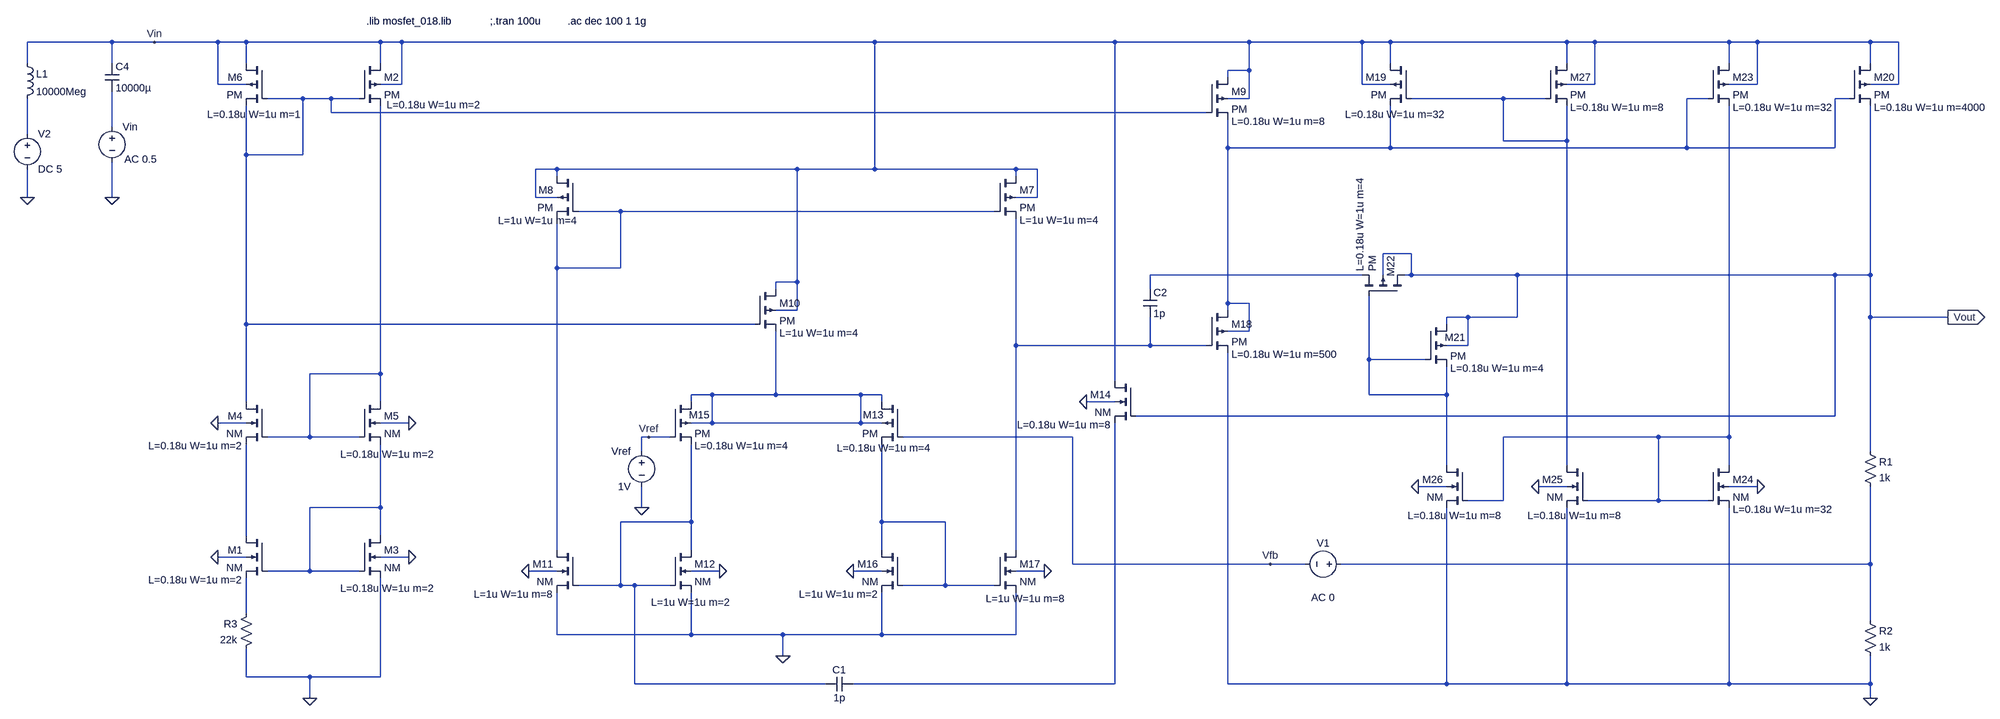
[diagram p0: schematic LDO_PSRR.asc]
LDO_PSRR.asc, the LTspice schematic file:
Version 4
SHEET 1 3764 1792
WIRE -512 80 -704 80
WIRE -416 80 -512 80
WIRE -272 80 -416 80
WIRE -208 80 -272 80
WIRE 96 80 -208 80
WIRE 144 80 96 80
WIRE 1216 80 144 80
WIRE 1760 80 1216 80
WIRE 2064 80 1760 80
WIRE 2320 80 2064 80
WIRE 2384 80 2320 80
WIRE 2784 80 2384 80
WIRE 2848 80 2784 80
WIRE 3152 80 2848 80
WIRE 3216 80 3152 80
WIRE 3472 80 3216 80
WIRE 3536 80 3472 80
WIRE -704 128 -704 80
WIRE -512 128 -512 80
WIRE -208 128 -208 80
WIRE 96 128 96 80
WIRE 2384 128 2384 80
WIRE 2784 128 2784 80
WIRE 3152 128 3152 80
WIRE 3472 128 3472 80
WIRE 2064 144 2064 80
WIRE 2064 144 2016 144
WIRE 2016 160 2016 144
WIRE -272 176 -272 80
WIRE -208 176 -272 176
WIRE 144 176 144 80
WIRE 144 176 96 176
WIRE 2320 176 2320 80
WIRE 2384 176 2320 176
WIRE 2848 176 2848 80
WIRE 2848 176 2784 176
WIRE 3216 176 3216 80
WIRE 3216 176 3152 176
WIRE 3536 176 3536 80
WIRE 3536 176 3472 176
WIRE -80 208 -160 208
WIRE -16 208 -80 208
WIRE 48 208 -16 208
WIRE 2064 208 2064 144
WIRE 2064 208 2016 208
WIRE 2640 208 2432 208
WIRE 2736 208 2640 208
WIRE 3104 208 3056 208
WIRE 3424 208 3392 208
WIRE -16 240 -16 208
WIRE 1968 240 -16 240
WIRE -512 272 -512 192
WIRE -704 288 -704 208
WIRE 2640 304 2640 208
WIRE 2784 304 2784 224
WIRE 2784 304 2640 304
WIRE 2016 320 2016 256
WIRE 2384 320 2384 224
WIRE 2384 320 2016 320
WIRE 3056 320 3056 208
WIRE 3056 320 2384 320
WIRE 3392 320 3392 208
WIRE 3392 320 3056 320
WIRE -208 336 -208 224
WIRE -80 336 -80 208
WIRE -80 336 -208 336
WIRE 496 368 448 368
WIRE 1040 368 496 368
WIRE 1216 368 1216 80
WIRE 1216 368 1040 368
WIRE 1536 368 1216 368
WIRE 1584 368 1536 368
WIRE 496 384 496 368
WIRE 1536 384 1536 368
WIRE -704 432 -704 368
WIRE -512 432 -512 352
WIRE 448 432 448 368
WIRE 496 432 448 432
WIRE 1584 432 1584 368
WIRE 1584 432 1536 432
WIRE 640 464 544 464
WIRE 1488 464 640 464
WIRE 2432 560 2368 560
WIRE 496 592 496 480
WIRE 640 592 640 464
WIRE 640 592 496 592
WIRE 2320 608 1840 608
WIRE 2368 608 2368 560
WIRE 2432 608 2432 560
WIRE 2432 608 2416 608
WIRE 2672 608 2432 608
WIRE 3392 608 2672 608
WIRE 3472 608 3472 224
WIRE 3472 608 3392 608
WIRE 1040 624 1040 368
WIRE 1040 624 992 624
WIRE 992 640 992 624
WIRE 1840 640 1840 608
WIRE 2016 672 2016 320
WIRE 2064 672 2016 672
WIRE 1040 688 1040 624
WIRE 1040 688 992 688
WIRE 2016 688 2016 672
WIRE 2560 704 2512 704
WIRE 2672 704 2672 608
WIRE 2672 704 2560 704
WIRE 3472 704 3472 608
WIRE 3648 704 3472 704
WIRE -208 720 -208 336
WIRE 944 720 -208 720
WIRE 2512 720 2512 704
WIRE 2064 736 2064 672
WIRE 2064 736 2016 736
WIRE 1536 768 1536 480
WIRE 1840 768 1840 704
WIRE 1840 768 1536 768
WIRE 1968 768 1840 768
WIRE 2560 768 2560 704
WIRE 2560 768 2512 768
WIRE 2336 800 2336 656
WIRE 2464 800 2336 800
WIRE 96 832 96 224
WIRE 96 832 -64 832
WIRE 1760 848 1760 80
WIRE 848 880 800 880
WIRE 992 880 992 736
WIRE 992 880 848 880
WIRE 1184 880 992 880
WIRE 1232 880 1184 880
WIRE 2336 880 2336 800
WIRE 2512 880 2512 816
WIRE 2512 880 2336 880
WIRE -208 896 -208 720
WIRE 96 896 96 832
WIRE 800 896 800 880
WIRE 1232 896 1232 880
WIRE 1760 896 1696 896
WIRE 3392 928 3392 608
WIRE 3392 928 1808 928
WIRE -208 944 -272 944
WIRE 160 944 96 944
WIRE 848 944 848 880
WIRE 848 944 800 944
WIRE 1184 944 1184 880
WIRE 1184 944 848 944
WIRE 1232 944 1184 944
WIRE -64 976 -64 832
WIRE -64 976 -160 976
WIRE 48 976 -64 976
WIRE 704 976 688 976
WIRE 752 976 704 976
WIRE 1664 976 1280 976
WIRE 2992 976 2640 976
WIRE 3152 976 3152 224
WIRE 3152 976 2992 976
WIRE 688 1008 688 976
WIRE 3472 1008 3472 704
WIRE 2512 1040 2512 880
WIRE 2784 1040 2784 304
WIRE 3152 1040 3152 976
WIRE 2512 1088 2448 1088
WIRE 2784 1088 2720 1088
WIRE 3216 1088 3152 1088
WIRE 2640 1120 2640 976
WIRE 2640 1120 2560 1120
WIRE 2992 1120 2992 976
WIRE 2992 1120 2832 1120
WIRE 3104 1120 2992 1120
WIRE 96 1136 96 992
WIRE 96 1136 -64 1136
WIRE 688 1136 688 1088
WIRE 800 1168 800 992
WIRE 800 1168 640 1168
WIRE 1232 1168 1232 992
WIRE 1376 1168 1232 1168
WIRE -208 1200 -208 992
WIRE 96 1200 96 1136
WIRE 496 1232 496 592
WIRE 800 1232 800 1168
WIRE 1232 1232 1232 1168
WIRE 1536 1232 1536 768
WIRE -208 1248 -272 1248
WIRE 160 1248 96 1248
WIRE 1664 1264 1664 976
WIRE 2112 1264 1664 1264
WIRE 2192 1264 2112 1264
WIRE 3472 1264 3472 1088
WIRE 3472 1264 2272 1264
WIRE -64 1280 -64 1136
WIRE -64 1280 -160 1280
WIRE 48 1280 -64 1280
WIRE 496 1280 432 1280
WIRE 864 1280 800 1280
WIRE 1232 1280 1168 1280
WIRE 1600 1280 1536 1280
WIRE 640 1312 640 1168
WIRE 640 1312 544 1312
WIRE 672 1312 640 1312
WIRE 752 1312 672 1312
WIRE 1376 1312 1376 1168
WIRE 1376 1312 1280 1312
WIRE 1488 1312 1376 1312
WIRE -208 1376 -208 1296
WIRE 3472 1392 3472 1264
WIRE 496 1424 496 1328
WIRE 800 1424 800 1328
WIRE 800 1424 496 1424
WIRE 1008 1424 800 1424
WIRE 1232 1424 1232 1328
WIRE 1232 1424 1008 1424
WIRE 1536 1424 1536 1328
WIRE 1536 1424 1232 1424
WIRE 1008 1472 1008 1424
WIRE -208 1520 -208 1456
WIRE -64 1520 -208 1520
WIRE 96 1520 96 1296
WIRE 96 1520 -64 1520
WIRE 672 1536 672 1312
WIRE 1104 1536 672 1536
WIRE 1760 1536 1760 944
WIRE 1760 1536 1168 1536
WIRE 2016 1536 2016 784
WIRE 2512 1536 2512 1136
WIRE 2512 1536 2016 1536
WIRE 2784 1536 2784 1136
WIRE 2784 1536 2512 1536
WIRE 3152 1536 3152 1136
WIRE 3152 1536 2784 1536
WIRE 3472 1536 3472 1472
WIRE 3472 1536 3152 1536
WIRE -64 1568 -64 1520
WIRE 3472 1568 3472 1536
FLAG 432 1280 0
FLAG 864 1280 0
FLAG 1168 1280 0
FLAG 1600 1280 0
FLAG 1008 1472 0
FLAG -512 432 0
FLAG 3472 1568 0
FLAG 3216 1088 0
FLAG 2720 1088 0
FLAG 2448 1088 0
FLAG 3648 704 Vout
IOPIN 3648 704 Out
FLAG 688 1136 0
FLAG 704 976 Vref
FLAG -416 80 Vin
FLAG 2112 1264 Vfb
FLAG -272 1248 0
FLAG 160 1248 0
FLAG -64 1568 0
FLAG -272 944 0
FLAG 160 944 0
FLAG -704 432 0
FLAG 1696 896 0
SYMBOL pmos4 48 128 R0
WINDOW 123 62 94 Left 2
SYMATTR Value2 L=0.18u W=1u m=2
SYMATTR InstName M2
SYMATTR Value PM
SYMBOL pmos4 1488 384 R0
WINDOW 123 56 100 Left 2
SYMATTR Value2 L=1u W=1u m=4
SYMATTR InstName M7
SYMATTR Value PM
SYMBOL pmos4 544 384 M0
WINDOW 123 1 101 Left 2
SYMATTR Value2 L=1u W=1u m=4
SYMATTR InstName M8
SYMATTR Value PM
SYMBOL pmos4 1968 160 R0
WINDOW 123 56 100 Left 2
SYMATTR Value2 L=0.18u W=1u m=8
SYMATTR InstName M9
SYMATTR Value PM
SYMBOL pmos4 944 640 R0
WINDOW 123 56 100 Left 2
SYMATTR Value2 L=1u W=1u m=4
SYMATTR InstName M10
SYMATTR Value PM
SYMBOL nmos4 544 1232 M0
WINDOW 123 56 100 Left 2
SYMATTR Value2 L=1u W=1u m=8
SYMATTR InstName M11
SYMATTR Value NM
SYMBOL nmos4 752 1232 R0
WINDOW 123 -43 119 Left 2
SYMATTR Value2 L=1u W=1u m=2
SYMATTR InstName M12
SYMATTR Value NM
SYMBOL pmos4 1280 896 M0
WINDOW 0 43 30 Left 2
WINDOW 123 -64 105 Left 2
SYMATTR InstName M13
SYMATTR Value2 L=0.18u W=1u m=4
SYMATTR Value PM
SYMBOL pmos4 752 896 R0
WINDOW 0 43 30 Left 2
WINDOW 123 56 100 Left 2
SYMATTR InstName M15
SYMATTR Value2 L=0.18u W=1u m=4
SYMATTR Value PM
SYMBOL nmos4 1280 1232 M0
WINDOW 123 56 100 Left 2
SYMATTR Value2 L=1u W=1u m=2
SYMATTR InstName M16
SYMATTR Value NM
SYMBOL nmos4 1488 1232 R0
WINDOW 123 -20 110 Left 2
SYMATTR Value2 L=1u W=1u m=8
SYMATTR InstName M17
SYMATTR Value NM
SYMBOL voltage -512 256 R0
WINDOW 123 28 90 Left 2
WINDOW 39 0 0 Left 0
SYMATTR Value2 AC 0.5
SYMATTR InstName Vin
SYMATTR Value ""
SYMBOL cap 1168 1520 R90
WINDOW 0 0 32 VBottom 2
WINDOW 3 32 32 VTop 2
SYMATTR InstName C1
SYMATTR Value 1p
SYMBOL res 3456 992 R0
SYMATTR InstName R1
SYMATTR Value 1k
SYMBOL res 3456 1376 R0
SYMATTR InstName R2
SYMATTR Value 1k
SYMBOL pmos4 1968 688 R0
WINDOW 123 56 100 Left 2
SYMATTR Value2 L=0.18u W=1u m=500
SYMATTR InstName M18
SYMATTR Value PM
SYMBOL cap 1824 640 R0
SYMATTR InstName C2
SYMATTR Value 1p
SYMBOL pmos4 2432 128 M0
WINDOW 123 -77 116 Left 2
SYMATTR Value2 L=0.18u W=1u m=32
SYMATTR InstName M19
SYMATTR Value PM
SYMBOL pmos4 3424 128 R0
WINDOW 123 56 100 Left 2
SYMATTR Value2 L=0.18u W=1u m=4000
SYMATTR InstName M20
SYMATTR Value PM
SYMBOL pmos4 2416 656 M270
WINDOW 123 56 100 Left 2
WINDOW 0 44 30 Left 2
SYMATTR Value2 L=0.18u W=1u m=4
SYMATTR InstName M22
SYMATTR Value PM
SYMBOL pmos4 2464 720 R0
WINDOW 123 56 100 Left 2
WINDOW 0 44 30 Left 2
SYMATTR Value2 L=0.18u W=1u m=4
SYMATTR InstName M21
SYMATTR Value PM
SYMBOL pmos4 3104 128 R0
WINDOW 123 56 100 Left 2
SYMATTR Value2 L=0.18u W=1u m=32
SYMATTR InstName M23
SYMATTR Value PM
SYMBOL nmos4 3104 1040 R0
WINDOW 123 56 100 Left 2
SYMATTR Value2 L=0.18u W=1u m=32
SYMATTR InstName M24
SYMATTR Value NM
SYMBOL nmos4 2832 1040 M0
WINDOW 123 -77 114 Left 2
SYMATTR Value2 L=0.18u W=1u m=8
SYMATTR InstName M25
SYMATTR Value NM
SYMBOL nmos4 2560 1040 M0
WINDOW 123 -77 114 Left 2
SYMATTR Value2 L=0.18u W=1u m=8
SYMATTR InstName M26
SYMATTR Value NM
SYMBOL pmos4 2736 128 R0
WINDOW 123 56 100 Left 2
SYMATTR Value2 L=0.18u W=1u m=8
SYMATTR InstName M27
SYMATTR Value PM
SYMBOL voltage 688 992 M0
WINDOW 123 0 0 Left 0
WINDOW 39 0 0 Left 0
SYMATTR InstName Vref
SYMATTR Value 1V
SYMBOL nmos4 -160 1200 M0
WINDOW 123 56 100 Left 2
SYMATTR Value2 L=0.18u W=1u m=2
SYMATTR InstName M1
SYMATTR Value NM
SYMBOL nmos4 48 1200 R0
WINDOW 123 -43 119 Left 2
SYMATTR Value2 L=0.18u W=1u m=2
SYMATTR InstName M3
SYMATTR Value NM
SYMBOL nmos4 -160 896 M0
WINDOW 123 56 100 Left 2
SYMATTR Value2 L=0.18u W=1u m=2
SYMATTR InstName M4
SYMATTR Value NM
SYMBOL nmos4 48 896 R0
WINDOW 123 -43 119 Left 2
SYMATTR Value2 L=0.18u W=1u m=2
SYMATTR InstName M5
SYMATTR Value NM
SYMBOL pmos4 -160 128 M0
WINDOW 123 -77 116 Left 2
SYMATTR Value2 L=0.18u W=1u m=1
SYMATTR InstName M6
SYMATTR Value PM
SYMBOL res -192 1360 M0
SYMATTR InstName R3
SYMATTR Value 22k
SYMBOL voltage 2288 1264 R90
WINDOW 0 -32 56 VBottom 2
WINDOW 3 32 56 VTop 2
WINDOW 123 60 56 VTop 2
WINDOW 39 0 0 Left 0
SYMATTR InstName V1
SYMATTR Value ""
SYMATTR Value2 AC 0
SYMBOL voltage -704 272 R0
WINDOW 123 0 0 Left 0
WINDOW 39 0 0 Left 0
SYMATTR InstName V2
SYMATTR Value DC 5
SYMBOL ind -720 112 R0
SYMATTR InstName L1
SYMATTR Value 10000Meg
SYMBOL cap -528 128 R0
SYMATTR InstName C4
SYMATTR Value 10000µ
SYMBOL nmos4 1808 848 M0
WINDOW 123 56 100 Left 2
SYMATTR Value2 L=0.18u W=1u m=8
SYMATTR InstName M14
SYMATTR Value NM
TEXT 64 32 Left 2 !.lib mosfet_018.lib
TEXT 344 32 Left 2 !;.tran 100u
TEXT 520 32 Left 2 !.ac dec 100 1 1g

The netlist it stands for:
* LDO_PSRR.asc
M2 Vin N001 N010 Vin PM L=0.18u W=1u m=2
M7 Vin N006 N008 Vin PM L=1u W=1u m=4
M8 Vin N006 N006 Vin PM L=1u W=1u m=4
M9 Vin N001 N003 Vin PM L=0.18u W=1u m=8
M10 Vin N001 N011 Vin PM L=1u W=1u m=4
M11 N006 N014 0 0 NM L=1u W=1u m=8
M12 N014 N014 0 0 NM L=1u W=1u m=2
M13 N011 Vfb N015 N011 PM L=0.18u W=1u m=4
M15 N011 Vref N014 N011 PM L=0.18u W=1u m=4
M16 N015 N015 0 0 NM L=1u W=1u m=2
M17 N008 N015 0 0 NM L=1u W=1u m=8
Vin N004 0 AC 0.5
C1 N019 N014 1p
R1 Vout N017 1k
R2 N017 0 1k
M18 N003 N008 0 N003 PM L=0.18u W=1u m=500
C2 N007 N008 1p
M19 Vin N002 N003 Vin PM L=0.18u W=1u m=32
M20 Vin N003 Vout Vin PM L=0.18u W=1u m=4000
M22 Vout N009 N007 Vout PM L=0.18u W=1u m=4
M21 Vout N009 N009 Vout PM L=0.18u W=1u m=4
M23 Vin N003 N012 Vin PM L=0.18u W=1u m=32
M24 N012 N012 0 0 NM L=0.18u W=1u m=32
M25 N002 N012 0 0 NM L=0.18u W=1u m=8
M26 N009 N012 0 0 NM L=0.18u W=1u m=8
M27 Vin N002 N002 Vin PM L=0.18u W=1u m=8
Vref Vref 0 1V
M1 N016 N013 N018 0 NM L=0.18u W=1u m=2
M3 N013 N013 0 0 NM L=0.18u W=1u m=2
M4 N001 N010 N016 0 NM L=0.18u W=1u m=2
M5 N010 N010 N013 0 NM L=0.18u W=1u m=2
M6 Vin N001 N001 Vin PM L=0.18u W=1u m=1
R3 N018 0 22k
V1 N017 Vfb AC 0
V2 N005 0 DC 5
L1 Vin N005 10000Meg
C4 Vin N004 10000µ
M14 Vin Vout N019 0 NM L=0.18u W=1u m=8
.model NMOS NMOS
.model PMOS PMOS
.lib standard.mos
.lib mosfet_018.lib
;.tran 100u
.ac dec 100 1 1g
.backanno
.end